# EAGLE design Parallel CS V5 (EAGLE 7.2.0)

## Sheet 1 of 2: Input Layer
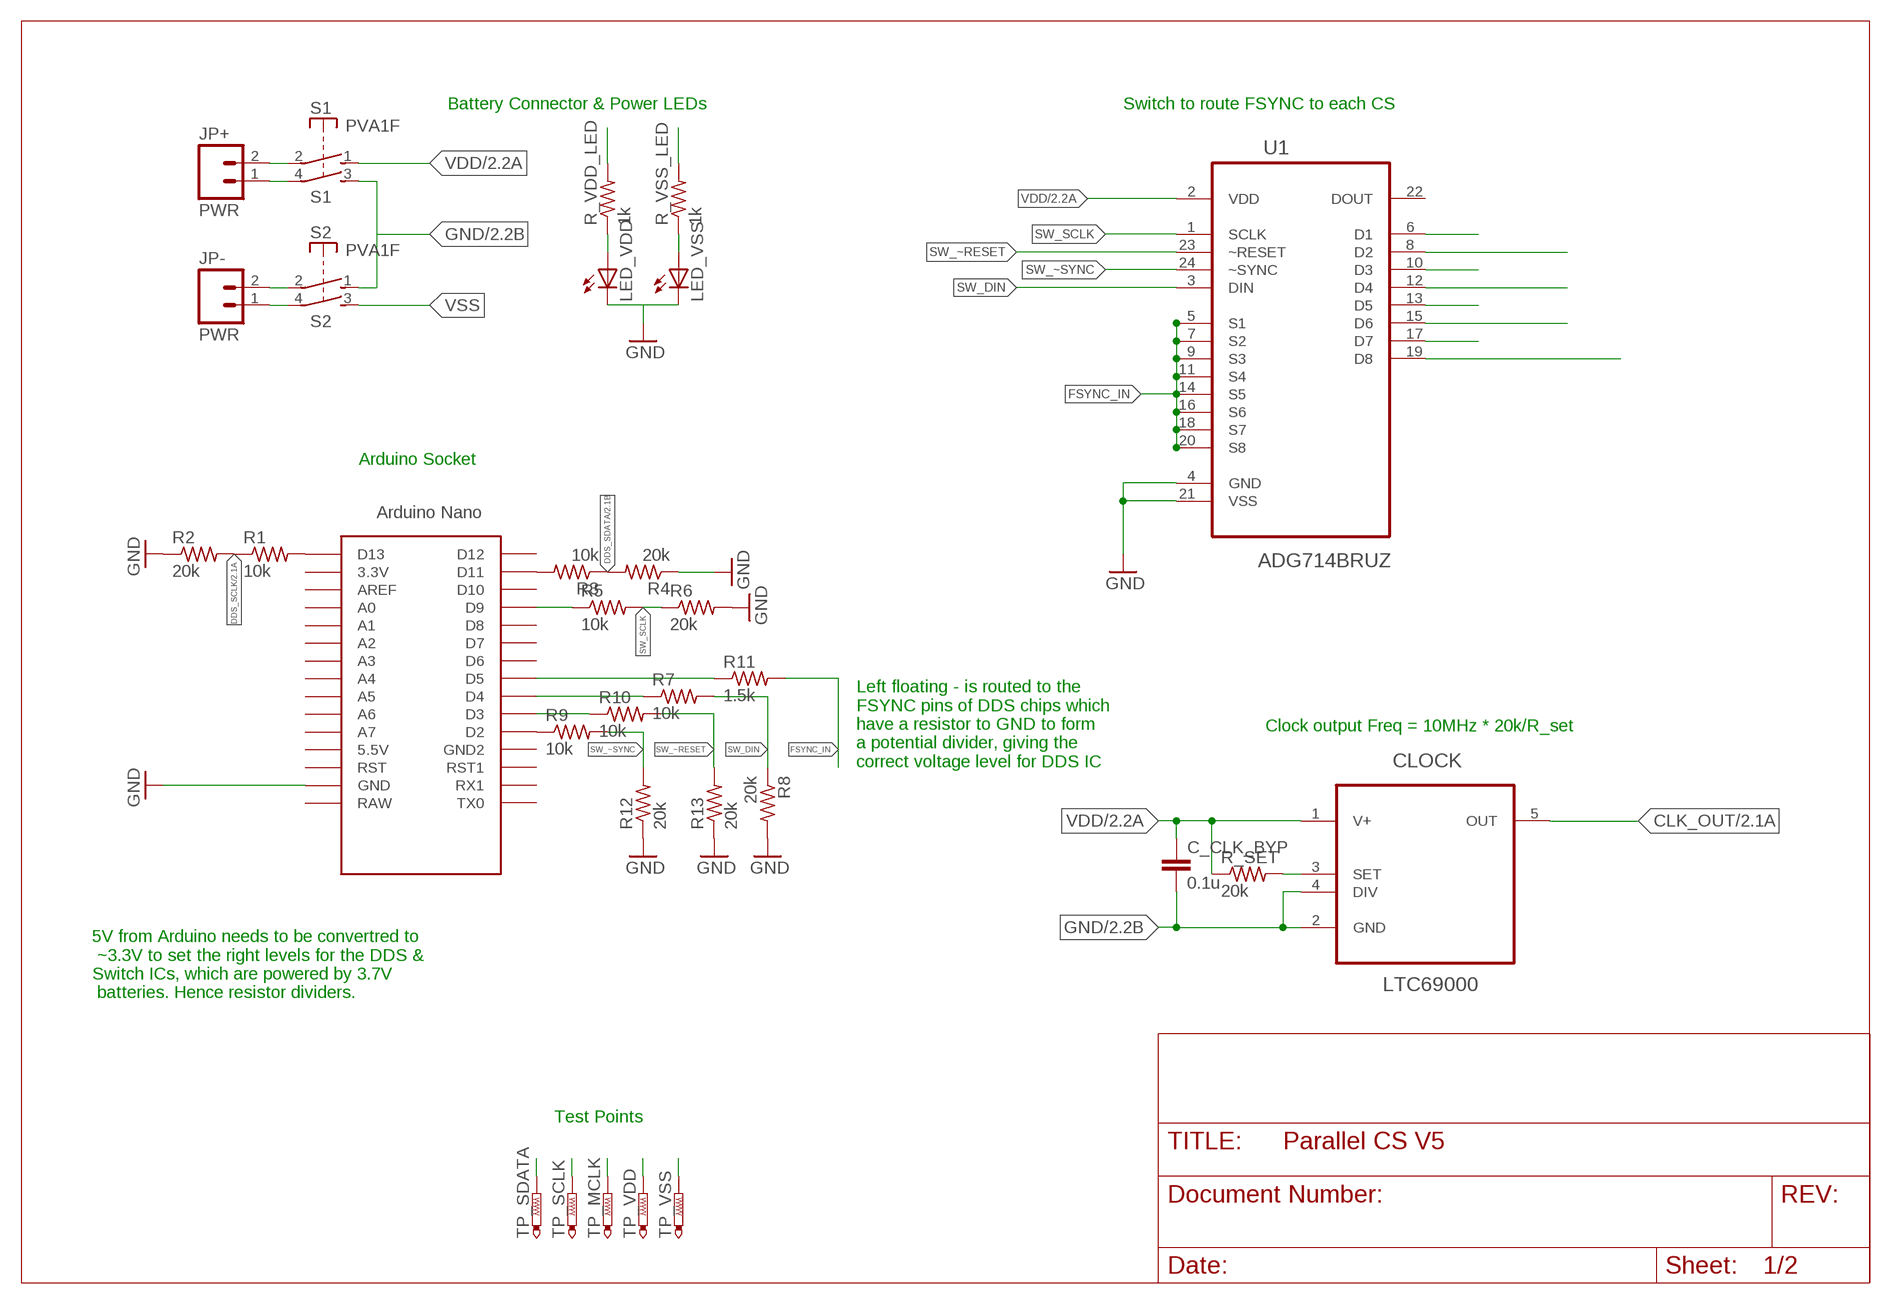
[diagram p0: schematic, sheet 1]

### Parts
C_CLK_BYP  0.1u  C-EUC0805  [C0805]
CLOCK  LTC69000  [SOT23-5L]
JP+  PWR  M02-JST-2MM-SMT  [JST-2-SMD]
JP-  PWR  M02-JST-2MM-SMT  [JST-2-SMD]
LED_VDD  LEDSML0805  [SML0805]
LED_VSS  LEDSML0805  [SML0805]
R1  10k  R-US_R0805  [R0805]
R2  20k  R-US_R0805  [R0805]
R3  10k  R-US_R0805  [R0805]
R4  20k  R-US_R0805  [R0805]
R5  10k  R-US_R0805  [R0805]
R6  20k  R-US_R0805  [R0805]
R7  10k  R-US_R0805  [R0805]
R8  20k  R-US_R0805  [R0805]
R9  10k  R-US_R0805  [R0805]
R10  10k  R-US_R0805  [R0805]
R11  1.5k  R-US_R0805  [R0805]
R12  20k  R-US_R0805  [R0805]
R13  20k  R-US_R0805  [R0805]
R_SET  20k  R-US_R0805  [R0805]
R_VDD_LED  1k  R-US_M0805  [M0805]
R_VSS_LED  1k  R-US_M0805  [M0805]
S1  PVA1F  [PVA1F]
S2  PVA1F  [PVA1F]
TP_MCLK  PTR1PAD1-13  [P1-13]
TP_SCLK  PTR1PAD1-13  [P1-13]
TP_SDATA  PTR1PAD1-13  [P1-13]
TP_VDD  PTR1PAD1-13  [P1-13]
TP_VSS  PTR1PAD1-13  [P1-13]
U1  ADG714BRUZ  [SOP65P640X120-24N]
U$1  NANO  [NANO]

### Nets
CLK_OUT: CLOCK.5(OUT) TP_MCLK.TP ; also sheet 2
DDS_SCLK: R1.1 R2.2 TP_SCLK.TP ; also sheet 2
DDS_SCLK_5V: R1.2 U$1.D13
DDS_SDATA: R3.1 R4.2 TP_SDATA.TP ; also sheet 2
FSYNC_CS1: U1.6(D1) ; also sheet 2
FSYNC_CS2: U1.8(D2)
FSYNC_CS3: U1.10(D3)
FSYNC_CS4: U1.12(D4)
FSYNC_CS5: U1.13(D5)
FSYNC_CS6: U1.15(D6)
FSYNC_CS7: U1.17(D7)
FSYNC_CS8: U1.19(D8)
FSYNC_IN: R11.2 U1.5(S1) U1.7(S2) U1.9(S3) U1.11(S4) U1.14(S5) U1.16(S6) U1.18(S7) U1.20(S8)
FSYNC_IN_5V: R11.1 U$1.D5
GND: C_CLK_BYP.2 CLOCK.2(GND) CLOCK.4(DIV) LED_VDD.C LED_VSS.C R2.1 R4.1 R6.2 R8.2 R12.1 R13.1 S1.3(2:S) S2.1(1:S) U1.4(GND) U1.21(VSS) U$1.GND ; also sheet 2
N$2: CLOCK.3(SET) R_SET.2
N$15: JP+.2 S1.2(1:P)
N$16: JP+.1 S1.4(2:P)
N$18: JP-.2 S2.2(1:P)
N$19: JP-.1 S2.4(2:P)
N$21: LED_VDD.A R_VDD_LED.1
N$22: LED_VSS.A R_VSS_LED.1
N$23: R3.2 U$1.D11
SW_DIN: R7.2 R8.1 U1.3(DIN)
SW_DIN_5V: R7.1 U$1.D4
SW_SCLK: R5.2 R6.1 U1.1(SCLK)
SW_SCLK_5V: R5.1 U$1.D9
SW_~RESET: R10.2 R13.2 U1.23(~RESET)
SW_~RESET_5V: R10.1 U$1.D3
SW_~SYNC: R9.2 R12.2 U1.24(~SYNC)
SW_~SYNC_5V: R9.1 U$1.D2
VDD: C_CLK_BYP.1 CLOCK.1(V+) R_SET.1 R_VDD_LED.2 S1.1(1:S) TP_VDD.TP U1.2(VDD) ; also sheet 2
VSS: R_VSS_LED.2 S2.3(2:S) TP_VSS.TP ; also sheet 2
Unconnected: U1.22(DOUT) U$1.3.3V U$1.5V(5.5V) U$1.A0 U$1.A1 U$1.A2 U$1.A3 U$1.A4 U$1.A5 U$1.A6 U$1.A7 U$1.AREF U$1.D6 U$1.D7 U$1.D8 U$1.D10 U$1.D12 U$1.GND1(GND2) U$1.ICSP1 U$1.ICSP2 U$1.ICSP3 U$1.ICSP4 U$1.ICSP5 U$1.ICSP6 U$1.RAW U$1.RST U$1.RST1 U$1.RX1 U$1.TX0

### Notes on the sheet
- Battery Connector & Power LEDs | Switch to route FSYNC to each CS
- Arduino Socket
- Clock output Freq = 10MHz * 20k/R_set
- Left floating - is routed to the
  FSYNC pins of DDS chips which
  have a resistor to GND to form
  a potential divider, giving the 
  correct voltage level for DDS IC
- 5V from Arduino needs to be convertred to
   ~3.3V to set the right levels for the DDS & 
  Switch ICs, which are powered by 3.7V
   batteries. Hence resistor dividers.
- Test Points

## Sheet 2 of 2: Current Source Block
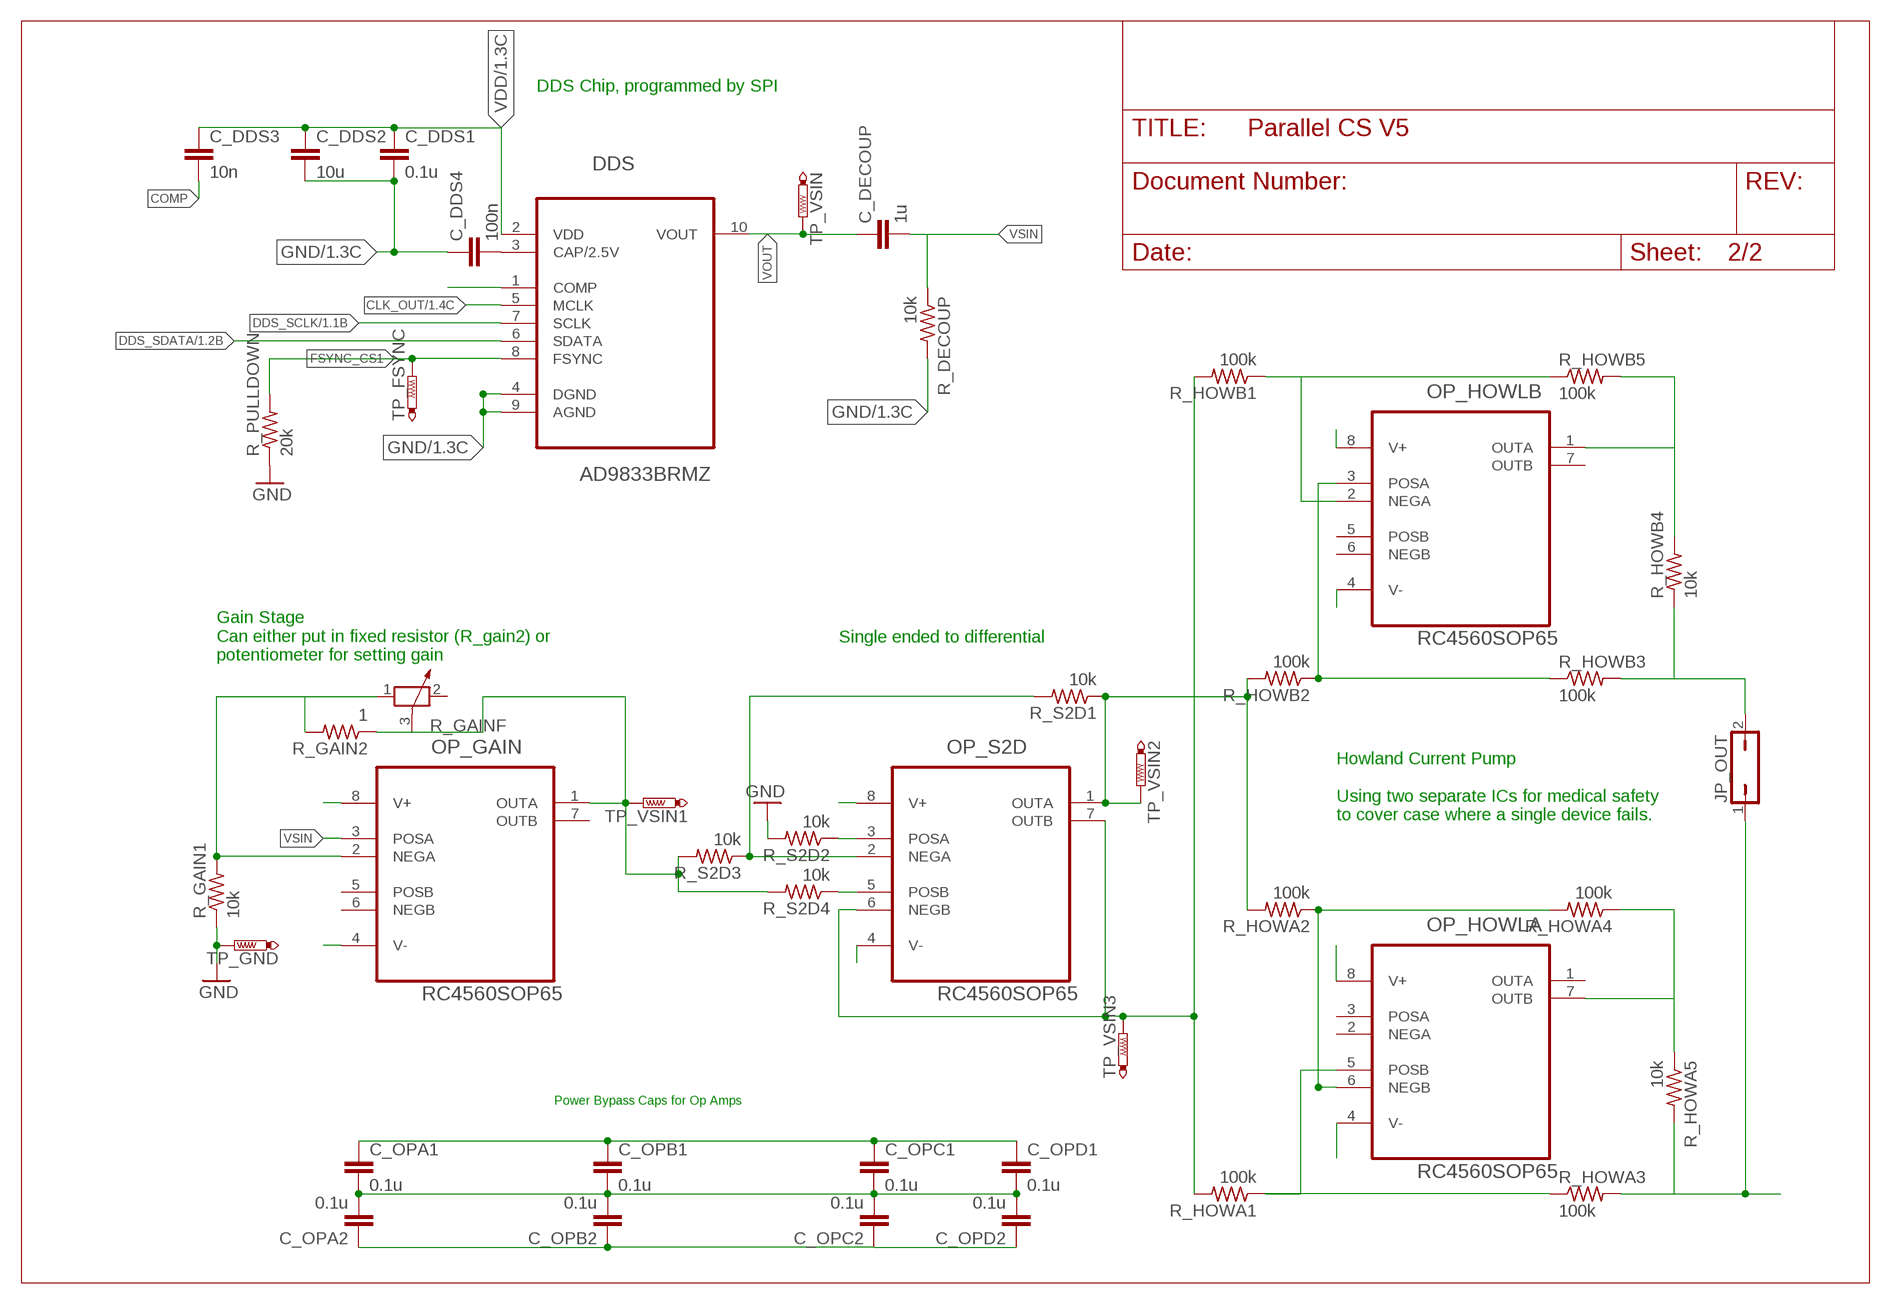
[diagram p1: schematic, sheet 2]

### Parts
C_DDS1  0.1u  C-EUC0805  [C0805]
C_DDS2  10u  C-EUC0805  [C0805]
C_DDS3  10n  C-EUC0805  [C0805]
C_DDS4  100n  C-EUC0805  [C0805]
C_DECOUP  1u  C-EUC0805  [C0805]
C_OPA1  0.1u  C-EUC0805  [C0805]
C_OPA2  0.1u  C-EUC0805  [C0805]
C_OPB1  0.1u  C-EUC0805  [C0805]
C_OPB2  0.1u  C-EUC0805  [C0805]
C_OPC1  0.1u  C-EUC0805  [C0805]
C_OPC2  0.1u  C-EUC0805  [C0805]
C_OPD1  0.1u  C-EUC0805  [C0805]
C_OPD2  0.1u  C-EUC0805  [C0805]
DDS  AD9833BRMZ  [SOP50P490X110-10N]
JP_OUT  JP1Q  [JP1]
OP_GAIN  RC4560SOP65  [SOP65P490X109-8N]
OP_HOWLA  RC4560SOP65  [SOP65P490X109-8N]
OP_HOWLB  RC4560SOP65  [SOP65P490X109-8N]
OP_S2D  RC4560SOP65  [SOP65P490X109-8N]
R_DECOUP  10k  R-US_R0805  [R0805]
R_GAIN1  10k  R-US_R0805  [R0805]
R_GAIN2  1  R-US_R0805  [R0805]
R_GAINF  POTENTIOMETER_PT-10  [PT-10]
R_HOWA1  100k  R-US_R0805  [R0805]
R_HOWA2  100k  R-US_R0805  [R0805]
R_HOWA3  100k  R-US_R0805  [R0805]
R_HOWA4  100k  R-US_R0805  [R0805]
R_HOWA5  10k  R-US_R0805  [R0805]
R_HOWB1  100k  R-US_R0805  [R0805]
R_HOWB2  100k  R-US_R0805  [R0805]
R_HOWB3  100k  R-US_R0805  [R0805]
R_HOWB4  10k  R-US_R0805  [R0805]
R_HOWB5  100k  R-US_R0805  [R0805]
R_PULLDOWN  20k  R-US_R0805  [R0805]
R_S2D1  10k  R-US_R0805  [R0805]
R_S2D2  10k  R-US_R0805  [R0805]
R_S2D3  10k  R-US_R0805  [R0805]
R_S2D4  10k  R-US_R0805  [R0805]
TP_FSYNC  PTR1PAD1-13  [P1-13]
TP_GND  PTR1PAD1-13  [P1-13]
TP_VSIN  PTR1PAD1-13  [P1-13]
TP_VSIN1  PTR1PAD1-13  [P1-13]
TP_VSIN2  PTR1PAD1-13  [P1-13]
TP_VSIN3  PTR1PAD1-13  [P1-13]

### Nets
CLK_OUT: DDS.5(MCLK) ; also sheet 1
COMP: C_DDS3.2 DDS.1(COMP)
DDS_SCLK: DDS.7(SCLK) ; also sheet 1
DDS_SDATA: DDS.6(SDATA) ; also sheet 1
FSYNC_CS1: DDS.8(FSYNC) R_PULLDOWN.2 TP_FSYNC.TP ; also sheet 1
GND: C_DDS1.2 C_DDS2.2 C_DDS4.1 C_OPA1.2 C_OPA2.2 C_OPB1.2 C_OPB2.2 C_OPC1.2 C_OPC2.2 C_OPD1.2 C_OPD2.2 DDS.4(DGND) DDS.9(AGND) R_DECOUP.2 R_GAIN1.1 R_PULLDOWN.1 R_S2D2.2 TP_GND.TP ; also sheet 1
N$1: C_DDS4.2 DDS.3(CAP/2.5V)
N$3: OP_GAIN.1(OUTA) R_GAIN2.1 R_GAINF.3 R_S2D3.2 R_S2D4.2 TP_VSIN1.TP
N$4: OP_S2D.6(NEGB) OP_S2D.7(OUTB) R_HOWA1.2 R_HOWB1.2 TP_VSIN3.TP
N$5: OP_GAIN.2(NEGA) R_GAIN1.2 R_GAIN2.2 R_GAINF.1
N$6: OP_S2D.5(POSB) R_S2D4.1
N$7: OP_HOWLA.5(POSB) R_HOWA1.1 R_HOWA3.1
N$8: OP_S2D.1(OUTA) R_HOWA2.2 R_HOWB2.2 R_S2D1.1 TP_VSIN2.TP
N$9: OP_S2D.3(POSA) R_S2D2.1
N$10: OP_S2D.2(NEGA) R_S2D1.2 R_S2D3.1
N$11: OP_HOWLB.3(POSA) R_HOWB2.1 R_HOWB3.1
N$12: OP_HOWLB.2(NEGA) R_HOWB1.1 R_HOWB5.1
N$13: JP_OUT.2 R_HOWB3.2 R_HOWB4.1
N$14: JP_OUT.1 R_HOWA3.2 R_HOWA5.2
N$17: OP_HOWLA.7(OUTB) R_HOWA4.1 R_HOWA5.1
N$20: OP_HOWLA.6(NEGB) R_HOWA2.1 R_HOWA4.2
N$24: OP_HOWLB.1(OUTA) R_HOWB4.2 R_HOWB5.2
VDD: C_DDS1.1 C_DDS2.1 C_DDS3.1 C_OPA1.1 C_OPB1.1 C_OPC1.1 C_OPD1.1 DDS.2(VDD) OP_GAIN.8(V+) OP_HOWLA.8(V+) OP_HOWLB.8(V+) OP_S2D.8(V+) ; also sheet 1
VOUT: C_DECOUP.1 DDS.10(VOUT) TP_VSIN.TP
VSIN: C_DECOUP.2 OP_GAIN.3(POSA) R_DECOUP.1
VSS: C_OPA2.1 C_OPB2.1 C_OPC2.1 C_OPD2.1 OP_GAIN.4(V-) OP_HOWLA.4(V-) OP_HOWLB.4(V-) OP_S2D.4(V-) ; also sheet 1
Unconnected: OP_GAIN.5(POSB) OP_GAIN.6(NEGB) OP_GAIN.7(OUTB) OP_HOWLA.1(OUTA) OP_HOWLA.2(NEGA) OP_HOWLA.3(POSA) OP_HOWLB.5(POSB) OP_HOWLB.6(NEGB) OP_HOWLB.7(OUTB) R_GAINF.2

### Notes on the sheet
- DDS Chip, programmed by SPI
- Single ended to differential
- Gain Stage
  Can either put in fixed resistor (R_gain2) or
  potentiometer for setting gain
- Howland Current Pump
  
  Using two separate ICs for medical safety
  to cover case where a single device fails.
- Power Bypass Caps for Op Amps

## Library data of the parts
C_CLK_BYP C_DDS1-C_DDS4 C_DECOUP C_OPA1 C_OPA2 C_OPB1 C_OPB2 C_OPC1 C_OPC2 C_OPD1 C_OPD2 = resistor:C-EU: CAPACITOR, European symbol
CLOCK = LTC6900:LTC69000: Low Power, 1kHz to 20MHz Resistor Set SOT-23 Oscillator
DDS = ad9833:AD9833BRMZ: Low Power 12.65 mW, 2.3 V to 5.5 V,Low Power 12.65 mW, 2.3 V to 5.5 V,Low Power 12.65 mW, 2.3 V to 5.5 V,Programmable Waveform Generator; MPN: AD9833BRMZ; OC_FARNELL: 1581966; OC_NEWARK: 19M1014; PACKAGE: MSOP-10; SUPPLIER: Analog Devices
JP+ JP- = SwitchBoard:M02: Header 2 Standard 2-pin 0.1" header. Use with straight break away headers (SKU : PRT-00116), right angle break away headers (PRT-00553), swiss pins (PRT-00743), machine pins (PRT-00117), and female headers (PRT-00115). Molex polarized connector foot print use with SKU : PRT-08233 with associated crimp pins and housings.
JP_OUT = jumper:JP1Q: JUMPER
LED_VDD LED_VSS = led:LED: LED OSRAM: - CHIPLED LG R971, LG N971, LY N971, LG Q971, LY Q971, LO R971, LY R971 LH N974, LH R974 LS Q976, LO Q976, LY Q976 LO Q996 - Hyper CHIPLED LW Q18S LB Q993, LB Q99A, LB R99A - SideLED LS A670, LO A670, LY A670, LG A670, LP A670 LB A673, LV A673, LT A673, LW A673 LH A674 LY A675 LS A676, LA A676, LO A676, LY A676, LW A676 LS A679, LY A679, LG A679 - Hyper Micro SIDELED® LS Y876, LA Y876, LO Y876, LY Y876 LT Y87S - SmartLED LW L88C, LW L88S LB L89C, LB L89S, LG L890 LS L89K, LO L89K, LY L89K LS L896, LA L896, LO L896, LY L896 - TOPLED LS T670, LO T670, LY T670, LG T670, LP T670 LSG T670, LSP T670, LSY T670, LOP T670, LYG T670 LG T671, LOG T671, LSG T671 LB T673, LV T673, LT T673, LW T673 LH T674 LS T676, LA T676, LO T676, LY T676, LB T676, LH T676, LSB T676, LW T676 LB T67C, LV T67C, LT T67C, LS T67K, LO T67K, LY T67K, LW E67C LS E67B, LA E67B, LO E67B, LY E67B, LB E67C, LV E67C, LT E67C LW T67C LS T679, LY T679, LG T679 LS T770, LO T770, LY T770, LG T770, LP T770 LB T773, LV T773, LT T773, LW T773 LH T774 LS E675, LA E675, LY E675, LS T675 LS T776, LA T776, LO T776, LY T776, LB T776 LHGB T686 LT T68C, LB T68C - Hyper Mini TOPLED® LB M676 - Mini TOPLED Santana® LG M470 LS M47K, LO M47K, LY M47K Source: http://www.osram.convergy.de LUXEON: - LUMILED® LXK2-PW12-R00, LXK2-PW12-S00, LXK2-PW14-U00, LXK2-PW14-V00 LXK2-PM12-R00, LXK2-PM12-S00, LXK2-PM14-U00 LXK2-PE12-Q00, LXK2-PE12-R00, LXK2-PE12-S00, LXK2-PE14-T00, LXK2-PE14-U00 LXK2-PB12-K00, LXK2-PB12-L00, LXK2-PB12-M00, LXK2-PB14-N00, LXK2-PB14-P00, LXK2-PB14-Q00 LXK2-PR12-L00, LXK2-PR12-M00, LXK2-PR14-Q00, LXK2-PR14-R00 LXK2-PD12-Q00, LXK2-PD12-R00, LXK2-PD12-S00 LXK2-PH12-R00, LXK2-PH12-S00 LXK2-PL12-P00, LXK2-PL12-Q00, LXK2-PL12-R00 Source: www.luxeon.com KINGBRIGHT: KA-3528ASYC Source: www.kingbright.com
OP_GAIN OP_HOWLA OP_HOWLB OP_S2D = RC4560:RC4560: RC4560 Op-Amp Texas Instruments
R1-R13 R_SET R_VDD_LED R_VSS_LED = resistor:R-US_: RESISTOR, American symbol
R_DECOUP R_GAIN1 R_GAIN2 R_HOWA1-R_HOWA5 R_HOWB1-R_HOWB5 R_PULLDOWN R_S2D1-R_S2D4 = rcl:R-US_: RESISTOR, American symbol
R_GAINF = rcl:POTENTIOMETER_: Potentiometer
S1 S2 = switch-misc:PVA1: ITT SWITCH
TP_FSYNC TP_GND TP_MCLK TP_SCLK TP_SDATA TP_VDD TP_VSIN TP_VSIN1-TP_VSIN3 TP_VSS = testpad:PTR1: TEST PIN
U1 = SwitchBoard:ADG714BRUZ: CMOS, Low Voltage Serially Controlled, Octal SPST Switches; MPN: ADG714BRUZ; OC_FARNELL: 9604367; OC_NEWARK: 59K1531; PACKAGE: TSSOP-24; SUPPLIER: Analog Devices
U$1 = Arduino-clone:NANO: Arduino Nano

## Board
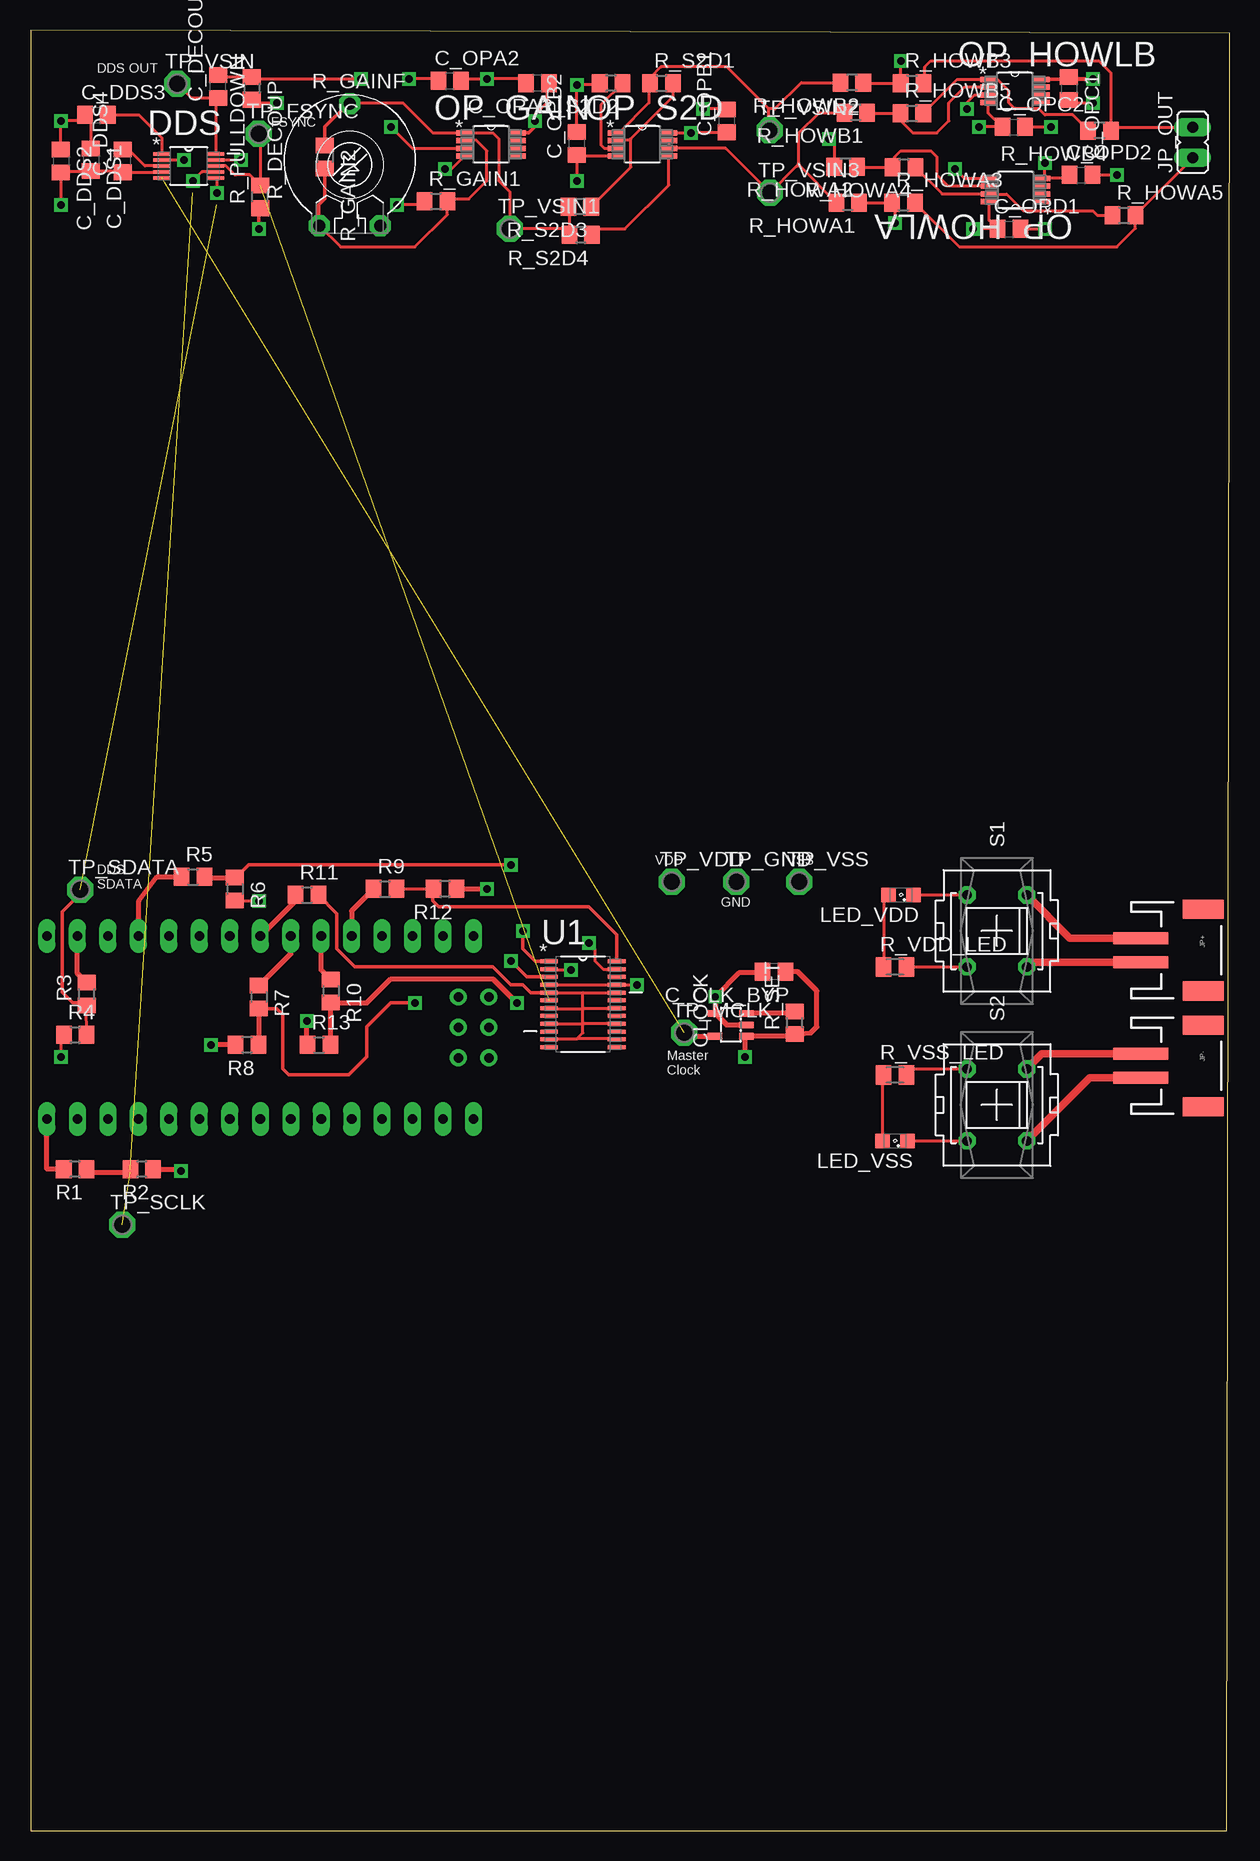
[diagram p2: board, top side]
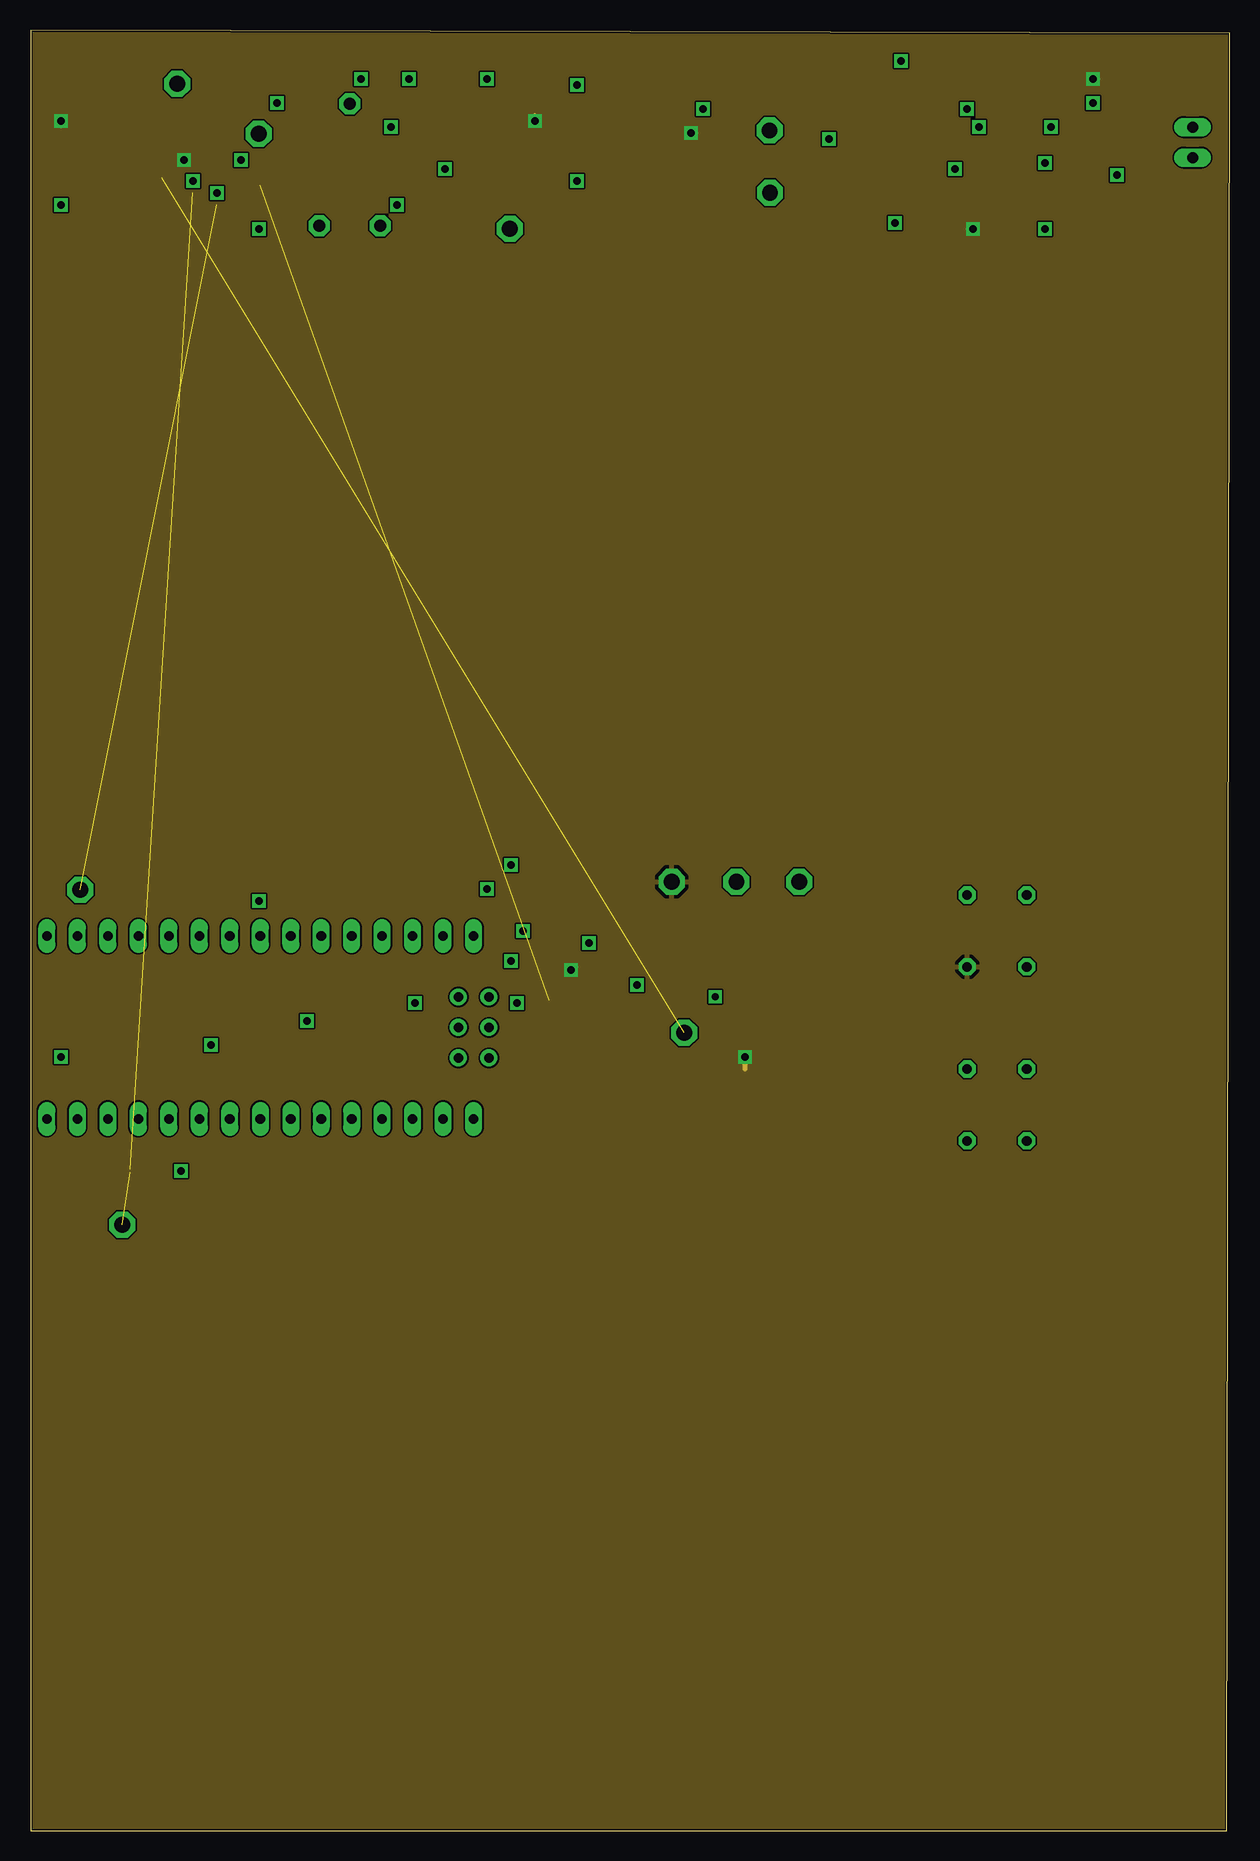
[diagram p3: board, inner layer VDD]
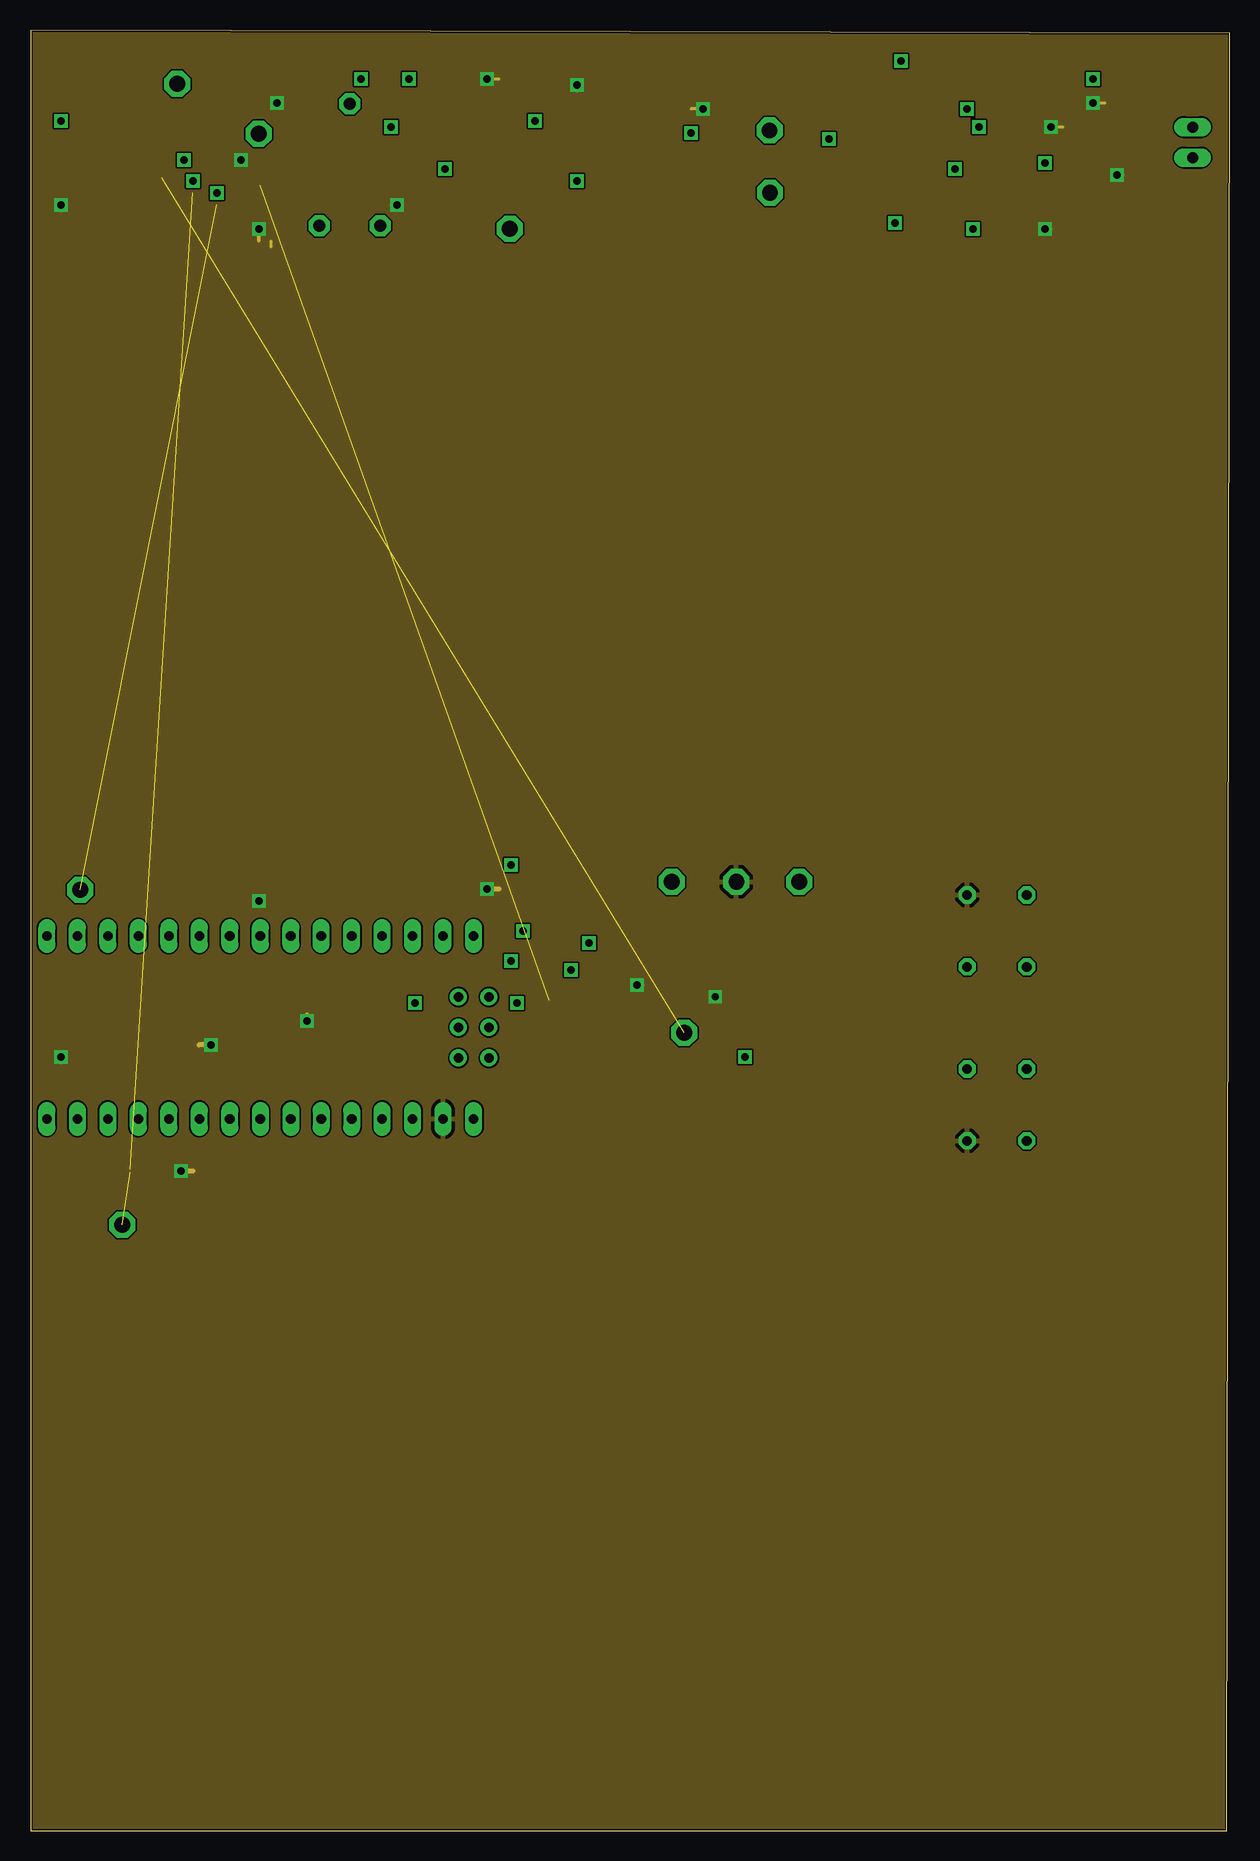
[diagram p4: board, inner layer GND]
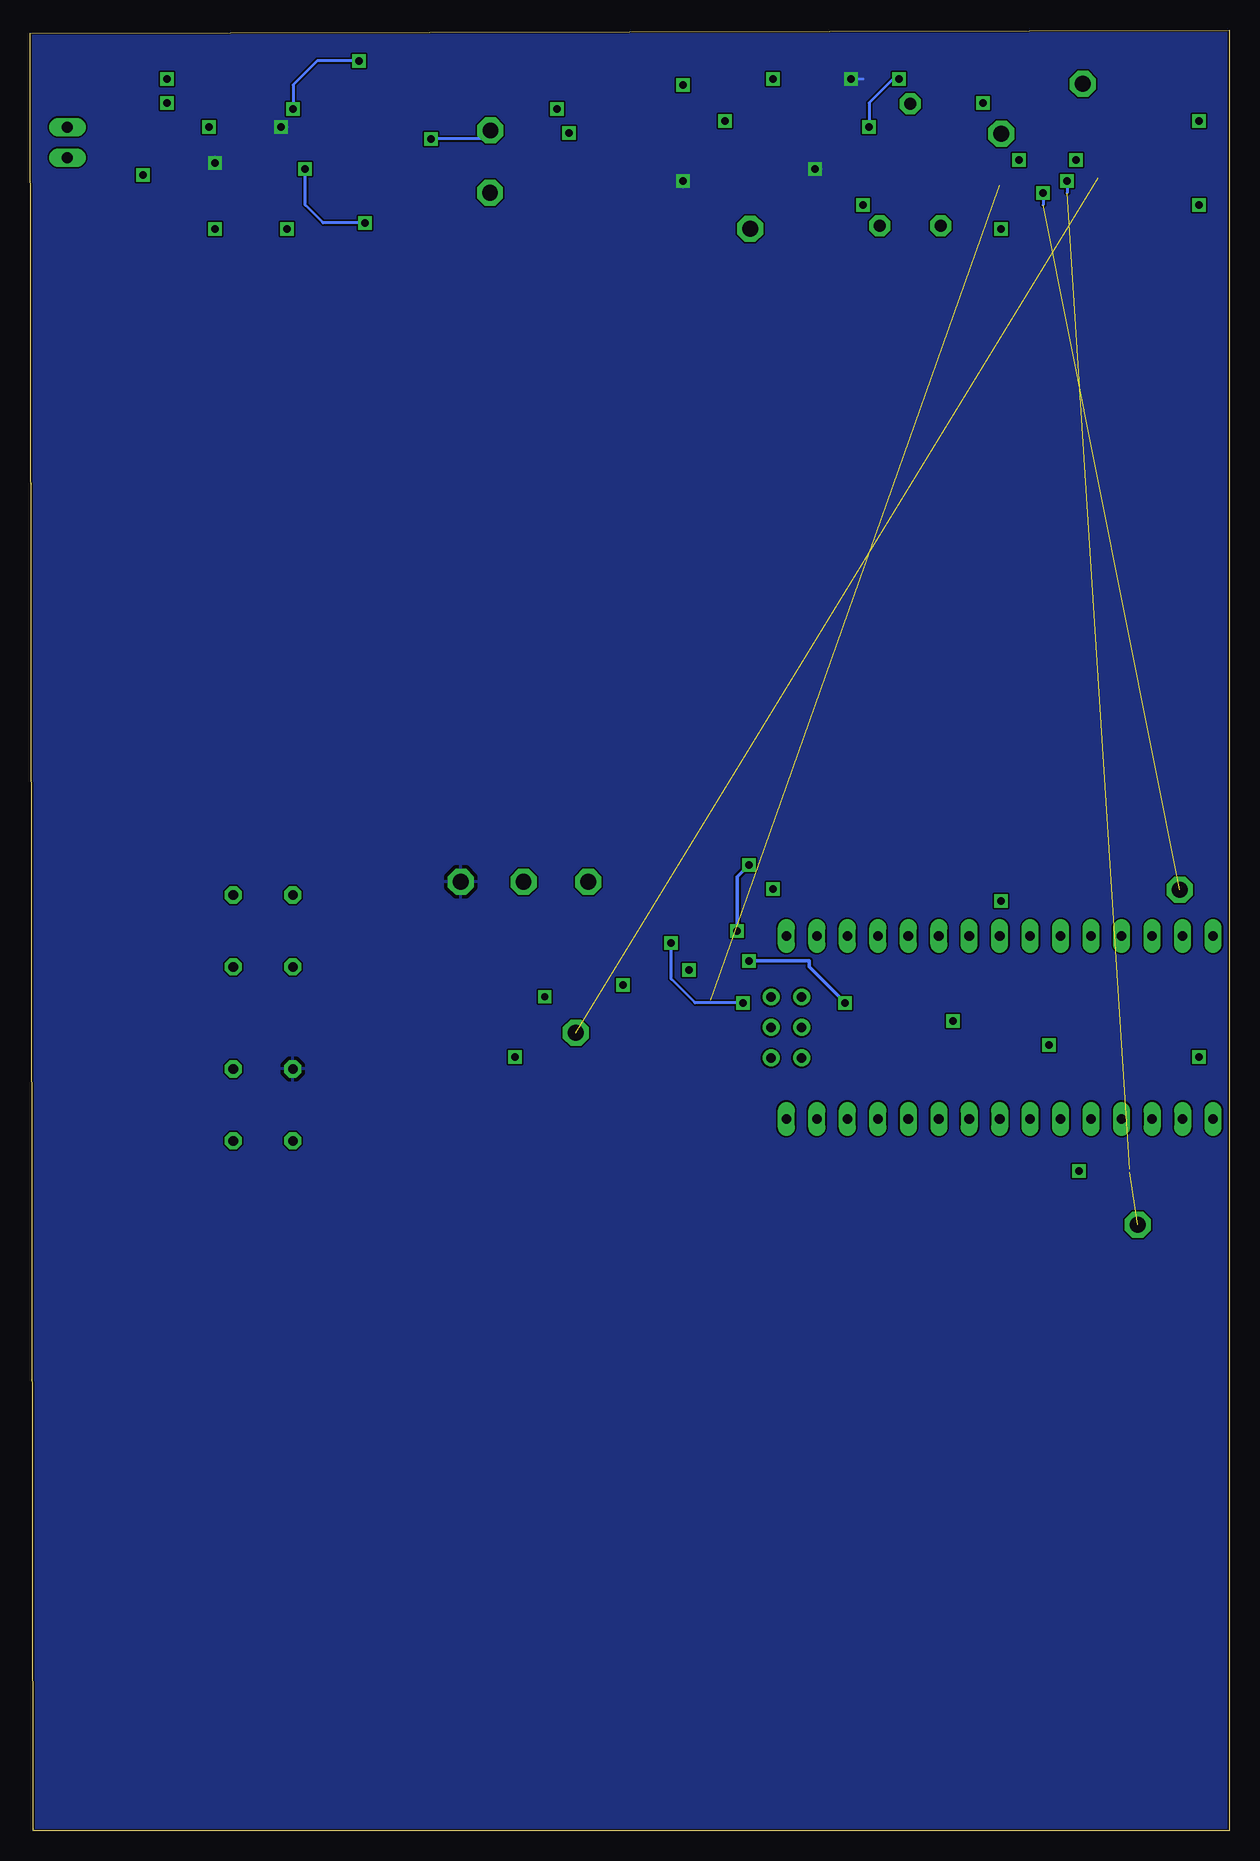
[diagram p5: board, bottom side, seen from below]

Size 99.92 x 150.08 mm. Coordinates in mm from the lower left corner, seen from the top.
Outline: 0,0 99.65,0 99.92,149.81 0,150.08 0,0
Copper layers (1*2*15*16): Top 0.035mm / dielectric 1.5mm / VDD 0.035mm / dielectric 0.15mm / GND 0.035mm / dielectric 0.2mm / Bottom 0.035mm
Design rules "SparkFun-4-layer": minimum track width 6mil, minimum drill 13mil, track to track 6mil, track to pad 6mil, pad to pad 6mil, via to via 6mil, smd to smd 6mil, copper to edge 6mil, drill to drill 8mil, minimum pad ring 12mil, minimum via ring 10mil, stop-mask expansion 4mil, vias tented up to drill 20mil, thermal gap 12mil

### Footprints (pad centres in the part's own frame; a part is rotated, then mirrored left to right if it is on the bottom)
C0805 = smd 1.3 x 1.5: 1 -0.95,0; 2 0.95,0
SOT23-5L = smd 0.55 x 1.2: 1 -0.95,-1.3; 2 0,-1.3; 3 0.95,-1.3; 4 0.95,1.3; 5 -0.95,1.3
SOP50P490X110-10N = smd 1.422 x 0.305: 1 -2.235,0.991; 2 -2.235,0.508; 3 -2.235,0; 4 -2.235,-0.508; 5 -2.235,-0.991; 6 2.235,-0.991; 7 2.235,-0.508; 8 2.235,0; 9 2.235,0.508; 10 2.235,0.991
JST-2-SMD = smd 1 x 4.6: 1 -1,-3.7; 2 1,-3.7 | smd 1.6 x 3.4: NC1 -3.4,1.5; NC2 3.4,1.5
JP1 = drill 0.914 long: 1 0,-1.27; 2 0,1.27
SML0805 = smd 1.2 x 1.2: A 1.05,0; C -1.05,0
SOP65P490X109-8N = smd 1.372 x 0.457: 1 -2.21,0.965; 2 -2.21,0.33; 3 -2.21,-0.33; 4 -2.21,-0.965; 5 2.21,-0.965; 6 2.21,-0.33; 7 2.21,0.33; 8 2.21,0.965
R0805 = smd 1.3 x 1.5: 1 -0.95,0; 2 0.95,0
PT-10 = drill 1.016 pad 1.778 octagon: 1 -2.54,-5.08; 2 2.54,-5.08; 3 0,5.08
M0805 = smd 1.3 x 1.6: 1 -0.95,0; 2 0.95,0
PVA1F = drill 0.813 octagon: 1 -2.997,2.489; 2 -2.997,-2.489; 3 2.997,2.489; 4 2.997,-2.489
P1-13 = drill 1.321 pad 2.159 octagon: TP 0,0
SOP65P640X120-24N = smd 1.473 x 0.356: 1 -2.819,3.581; 2 -2.819,2.921; 3 -2.819,2.286; 4 -2.819,1.626; 5 -2.819,0.965; 6 -2.819,0.33; 7 -2.819,-0.33; 8 -2.819,-0.965; 9 -2.819,-1.626; 10 -2.819,-2.286; 11 -2.819,-2.921; 12 -2.819,-3.581; 13 2.819,-3.581; 14 2.819,-2.921; 15 2.819,-2.286; 16 2.819,-1.626; 17 2.819,-0.965; 18 2.819,-0.33; 19 2.819,0.33; 20 2.819,0.965; 21 2.819,1.626; 22 2.819,2.286; 23 2.819,2.921; 24 2.819,3.581
NANO = drill 0.8 long: 3.3V -10.16,24.13; 5V -10.16,-1.27; A0 -10.16,19.05; A1 -10.16,16.51; A2 -10.16,13.97; A3 -10.16,11.43; A4 -10.16,8.89; A5 -10.16,6.35; A6 -10.16,3.81; A7 -10.16,1.27; AREF -10.16,21.59; D2 5.08,1.27; D3 5.08,3.81; D4 5.08,6.35; D5 5.08,8.89; D6 5.08,11.43; D7 5.08,13.97; D8 5.08,16.51; D9 5.08,19.05; D10 5.08,21.59; D11 5.08,24.13; D12 5.08,26.67; D13 -10.16,26.67; GND -10.16,-6.35; GND1 5.08,-1.27; RAW -10.16,-8.89; RST -10.16,-3.81; RST1 5.08,-3.81; RX1 5.08,-6.35; TX0 5.08,-8.89 | drill 0.8: ICSP1 -5.08,-10.16; ICSP2 -5.08,-7.62; ICSP3 -2.54,-10.16; ICSP4 -2.54,-7.62; ICSP5 0,-10.16; ICSP6 0,-7.62

### Placement (x,y rotation side)
C_CLK_BYP  61.92,71.59 180 top
C_DDS1  5,139.27 270 top
C_DDS2  2.5,139.16 270 top
C_DDS3  5.45,143 0 top
C_DDS4  7.65,139.18 90 top
C_DECOUP  15.59,145.38 90 top
C_OPA1  42.21,145.65 180 top
C_OPA2  34.9,145.85 0 top
C_OPB1  58,142.51 90 top
C_OPB2  45.5,140.62 90 top
C_OPC1  86.5,145.21 270 top
C_OPC2  81.9,142 0 top
C_OPD1  81.5,133.5 0 top
C_OPD2  87.5,138 0 top
CLOCK  58.32,67.18 90 top
DDS  13.15,138.75 0 top
JP+  96.18,73.4 270 top
JP-  96.18,63.75 270 top
JP_OUT  96.8,140.71 0 top
LED_VDD  72.5,78 180 top
LED_VSS  72,57.5 180 top
OP_GAIN  38.35,140.55 0 top
OP_HOWLA  82.05,136.75 180 top
OP_HOWLB  82,145 0 top
OP_S2D  50.95,140.55 0 top
R1  3.68,55.15 180 top
R2  9.23,55.15 180 top
R3  4.65,69.74 90 top
R4  3.69,66.35 0 top
R5  13.5,79.5 0 top
R6  17,78.5 270 top
R7  19,69.5 270 top
R8  18,65.5 180 top
R9  29.5,78.5 0 top
R10  25,70 270 top
R11  23,78 0 top
R12  34.5,78.5 180 top
R13  24,65.5 0 top
R_DECOUP  18.41,145.22 270 top
R_GAIN1  33.75,135.8 0 top
R_GAIN2  24.5,139.5 270 top
R_GAINF  26.57,138.85 0 top
R_HOWA1  68.07,135.7 180 top
R_HOWA2  67.89,138.7 180 top
R_HOWA3  72.71,135.7 0 top
R_HOWA4  72.75,138.65 180 top
R_HOWA5  91.09,134.65 0 top
R_HOWB1  68.73,143.2 180 top
R_HOWB2  68.41,145.7 180 top
R_HOWB3  73.43,145.65 0 top
R_HOWB4  89.05,141.7 180 top
R_HOWB5  73.41,143.15 0 top
R_PULLDOWN  19.09,136.18 90 top
R_S2D1  52.54,145.65 0 top
R_S2D2  48.35,145.65 180 top
R_S2D3  45.74,135.35 180 top
R_S2D4  45.82,133 180 top
R_SET  63.65,67.35 90 top
R_VDD_LED  72,72 0 top
R_VSS_LED  72,63 0 top
S1  80.5,75 90 top
S2  80.5,60.5 90 top
TP_FSYNC  18.97,141.43 0 top
TP_GND  58.79,79.09 0 top
TP_MCLK  54.43,66.51 0 top
TP_SCLK  7.61,50.51 0 top
TP_SDATA  4.11,78.43 0 top
TP_VDD  53.4,79.09 0 top
TP_VSIN  12.18,145.59 0 top
TP_VSIN1  39.91,133.51 0 top
TP_VSIN2  61.55,141.71 0 top
TP_VSIN3  61.59,136.51 0 top
TP_VSS  64.01,79.09 0 top
U1  46,68.89 0 top
U$1  28,69.5 90 top

### Tracks (layer width: path | path; a pad name or v marks a point on that pad's centre or on a via)
CLK_OUT  (1 unrouted)
  Top 0.406: TP_MCLK.TP 54.71,66.23 CLOCK.5
COMP
  Top 0.254: C_DDS3.2 9,143 10.91,141.09 DDS.1
DDS_SCLK  (via drill 0.6)  (2 unrouted)
  Top 0.254: R1.1 4.9,54.88 | DDS.7 15.38,138.25 14.25,138.25 v13.5,137.5
  Top 0.406: 4.9,54.88 8.28,54.88 R2.2
  Bottom 0.254: v13.5,137.5 13.5,136.5
DDS_SCLK_5V
  Top 0.406: R1.2 1.33,55.15 U$1.D13
DDS_SDATA  (via drill 0.6)  (1 unrouted)
  Top 0.254: R3.1 4.54,68.68 R4.2 | DDS.6 15.5,137.65 v15.5,136.5
  Top 0.305: R3.1 4.44,69 3.5,69 2.6,69.9 2.6,76.6 4.11,78.11 TP_SDATA.TP
  Bottom 0.254: v15.5,136.5 15.5,135.5
FSYNC_CS1  (1 unrouted)
  Top 0.254: DDS.8 16.25,138.75 17,138 18.22,138 R_PULLDOWN.2 19.09,141.31 TP_FSYNC.TP
FSYNC_IN
  Top 0.254: U1.5 46,69.86 | 46,69.86 U1.20 | U1.11 43.21,66 45.5,66 | 45.5,66 46,66.5 46,67.25 | 46,67.25 46,68.5 | 46,68.5 46,69.86 | U1.9 43.2,67.25 46,67.25 | U1.7 43.24,68.5 46,68.5 | U1.14 48.79,66 45.5,66 | U1.16 48.8,67.25 46,67.25 | U1.18 48.76,68.5 46,68.5
  Top 0.305: R11.2 25.5,76.45 25.5,73.5 27,72 38.5,72 40,70.5 41,70.5 41.65,69.86 U1.5
FSYNC_IN_5V
  Top 0.406: U$1.D5 22.05,77.52 R11.1
GND  (via drill 0.6)
  Top 0.254: v2.5,135.5 C_DDS2.2 2.61,138.32 C_DDS1.2 7.56,138.32 C_DDS4.1 7.66,138.24 DDS.4 | C_OPA2.2 36,146 v38,146 40.91,146 C_OPA1.2 | R_GAIN1.1 32.5,135.5 v30.5,135.5 | R_DECOUP.2 18.68,144 v20.5,144 | DDS.9 v17.5,139.25 | R6.2 17.15,77.5 v19,77.5 | R4.1 2.5,66.01 v2.5,64.5 | v50.5,70.5 48.84,70.5 U1.21 U1.4 | 45.5,141.5 C_OPB2.2 v45.5,145.5 47.5,145.5 47.5,145.55 R_S2D2.2 | C_OPB1.2 57.96,143.5 v56,143.5 | C_OPC2.2 v85,142 | C_OPD1.2 v84.5,133.5 | C_OPD2.2 v90.5,138 | C_OPC1.2 86.76,144 v88.5,144 | LED_VSS.C S2.1 | LED_VDD.C S1.3
  Top 0.305: R_PULLDOWN.1 19,135.14 v19,133.5
  Top 0.406: C_CLK_BYP.2 60.88,71.5 59,71.5 v57.02,69.52 CLOCK.4 57.97,67.18 CLOCK.2 | R2.1 12.5,55.15 v12.5,55 | R8.2 v15,65.5 | R13.1 23,65.5 v23,67.5 | R12.1 v38,78.5
  GND 0.254: v2.5,135.5 2.5,135 | 20,132.5 20,132 | v38,146 39,146 | v30.5,135.5 30,135.5 | v17.5,139.25 17.25,139.5 17.5,139.5 | v2.5,64.5 2.5,64 | v50.5,70.5 51,70.5 | v45.5,145.5 45.5,145 | v56,143.5 55,143.5 | v85,142 86,142 | v88.5,144 89.5,144 | v84.5,133.5 85,133.5 | v90.5,138 91,138
  GND 0.305: v19,133.5 19,132.5
  GND 0.406: v57.02,69.52 57,69.5 | v12.5,55 13.5,55 | v15,65.5 14,65.5 | v23,67.5 23,68 | v38,78.5 39,78.5
  pour GND: 105,153 105,150 105,-5 -9,-5 -11,-5 -11,153 -1,153
N$1
  Top 0.254: DDS.3 9.5,138.75 8.12,140.13 C_DDS4.2
N$2
  Top 0.406: R_SET.2 63.58,68.13 CLOCK.3
N$3
  Top 0.254: R_S2D3.2 44.87,135.27 R_S2D4.2 44.36,133.51 TP_VSIN1.TP 39.91,136.59 39,137.5 39,141 38.5,141.5 36.16,141.5 OP_GAIN.1 33.48,141.51 31,144 26.64,144 R_GAINF.3
  Top 0.305: R_GAIN2.1 24.5,142 26.43,143.93 R_GAINF.3
N$4
  Top 0.254: OP_S2D.7 OP_S2D.6 57.88,140.22 TP_VSIN3.TP 63.79,138.71 | 63.79,138.71 64,138.92 64,141.5 65.7,143.2 R_HOWB1.2 | R_HOWA1.2 64.11,138.71 63.79,138.71
N$5
  Top 0.254: 34.92,136.02 R_GAIN1.2 34.7,134.7 32,132 25.8,132 R_GAINF.1 | 35,136 36.5,136 38,137.5 38,140 37.12,140.88 OP_GAIN.2
  Top 0.305: R_GAINF.1 24,133.8 24,135.5 24.5,136 R_GAIN2.2 | 34.92,136.02 34.94,136 35,136
N$6
  Top 0.254: R_S2D4.1 47.27,133.5 49.5,133.5 53.16,137.16 OP_S2D.5
N$7  (via drill 0.6)
  Top 0.254: R_HOWA1.1 R_HOWA3.1 72,135.46 v72,134 | v77,138.5 77.78,137.72 OP_HOWLA.5
  Bottom 0.254: v72,134 75.5,134 77,135.5 v77,138.5
N$8  (via drill 0.6)
  Top 0.254: OP_S2D.1 49.02,141.51 51.5,144 51.5,145.56 R_S2D1.1 51.59,146.09 52.5,147 58,147 61.5,143.5 | TP_VSIN2.TP 61.5,141.76 61.5,143.5 | R_HOWB2.2 64.2,145.7 62,143.5 61.5,143.5 | v66.5,141 66.94,140.56 R_HOWA2.2
  Bottom 0.254: TP_VSIN2.TP 62.26,141 v66.5,141
N$9
  Top 0.254: R_S2D2.1 47.5,143.85 47.5,140.5 47.78,140.22 OP_S2D.3
N$10
  Top 0.254: R_S2D1.2 53.5,144.5 50,141 | 50,141 49.88,140.88 OP_S2D.2 | R_S2D3.1 50,138.66 50,141
N$11  (via drill 0.6)
  Top 0.254: R_HOWB2.1 69.41,145.65 R_HOWB3.1 72.5,145.67 v72.5,147.5 | v78,143.5 78,144 78.67,144.67 OP_HOWLB.3
  Bottom 0.254: v72.5,147.5 76,147.5 78,145.5 v78,143.5
N$12
  Top 0.254: R_HOWB1.1 69.73,143.15 R_HOWB5.1 72.5,143.11 72.5,142.5 73.5,141.5 75.5,141.5 76.5,142.5 76.5,144 77.83,145.33 OP_HOWLB.2
N$13
  Top 0.254: R_HOWB3.2 74.5,145.77 74.5,147 75,147.5 89,147.5 90,146.5 R_HOWB4.1 90.28,141.98 JP_OUT.2
N$14
  Top 0.254: R_HOWA3.2 77.36,132 90.5,132 92.04,133.54 R_HOWA5.2 96.8,139.41 JP_OUT.1
N$15
  Top 0.61: S1.2 83.39,72.4 JP+.2
N$16
  Top 0.61: S1.4 86.59,74.4 JP+.1
N$17
  Top 0.254: R_HOWA4.1 75.93,136.42 OP_HOWLA.7 79.86,136.4 81.3,136.4 82.7,135 88.5,135 88.85,134.65 R_HOWA5.1
N$18
  Top 0.61: S2.2 88.24,62.75 JP-.2
N$19
  Top 0.61: S2.4 84.24,64.75 JP-.1
N$20
  Top 0.254: R_HOWA2.1 68.89,138.65 R_HOWA4.2 72,138.85 72,139.5 72.5,140 75,140 75.5,139.5 75.5,138 76.42,137.08 OP_HOWLA.6
N$21
  Top 0.254: LED_VDD.A 71.05,77.6 R_VDD_LED.1
N$22
  Top 0.254: R_VSS_LED.1 70.95,62.9 LED_VSS.A
N$23
  Top 0.406: R3.2 3.87,71.47 U$1.D11
N$24
  Top 0.254: R_HOWB4.2 86.8,143 84.5,143 84,143.5 82,143.5 81.5,144 81.5,145 80.53,145.97 OP_HOWLB.1 77.17,145.97 R_HOWB5.2
SW_DIN  (via drill 0.6)
  Top 0.305: R7.2 19.05,68.5 20.5,68.5 21,68 21,63.5 21.5,63 26.5,63 28,64.5 28,67 30,69 v32,69 | v40,72.5 41.32,71.18 U1.3
  Top 0.406: R8.1 19,65.5 R7.2
  Bottom 0.305: v40,72.5 35,72.5 35,72 v32,69
SW_DIN_5V
  Top 0.406: R7.1 21.65,73.1 U$1.D4
SW_SCLK  (via drill 0.6)
  Top 0.254: R6.1 17.15,79.5
  Top 0.305: 17.15,79.5 18.15,80.5 v40,80.5 | v41,75 41,73.5 42.03,72.47 U1.1
  Top 0.406: R5.2 14.5,79.45 R6.1
  Bottom 0.305: v40,80.5 41,79.5 v41,75
SW_SCLK_5V
  Top 0.406: U$1.D9 9,74.63 9,77.5 10.5,79.5 R5.1
SW_~RESET  (via drill 0.6)
  Top 0.254: R10.2 24.85,68.9 | R13.2 24.5,65.15 | v46.5,74 47,73.5 47,72.5 47.69,71.81 U1.23
  Top 0.406: 24.85,68.9 24.95,68.8 R13.2 | R10.2 25.05,69 28,69 30,71 38.5,71 v40.5,69
  Bottom 0.254: v40.5,69 44.5,69 46.5,71 v46.5,74
SW_~RESET_5V
  Top 0.406: R10.1 24.19,71.76 U$1.D3
SW_~SYNC
  Top 0.254: R9.2 R12.2
  Top 0.305: R12.2 33.5,78.45 33.5,77.5 34,77 46.5,77 48.82,74.68 U1.24
SW_~SYNC_5V
  Top 0.406: R9.1 26.73,76.68 U$1.D2
VDD  (via drill 0.6)
  Top 0.254: DDS.2 10.92,139.25 v12.75,139.25 | C_DDS1.1 5,142.5 C_DDS3.1 4,142.5 v2.5,142.5 C_DDS2.1 | U1.2 43.24,71.75 v45,71.75 | C_OPA1.1 43,145.49 43,144 42,143 v42,142.5 | OP_S2D.8 53.17,141.5 v55,141.5 57.94,141.5 C_OPB1.1 | v78.5,133.5 C_OPD1.1 79.84,134.21 OP_HOWLA.8 | OP_HOWLB.8 84.25,146 | R_VDD_LED.2 S1.1
  Top 0.305: OP_GAIN.8 40.58,141.5 41.5,141.5 42,142 v42,142.5 | C_OPC1.1 86.66,146 v88.5,146 88.47,145.97 OP_HOWLB.8
  Top 0.406: C_CLK_BYP.1 63.91,71.59 65.5,70 65.5,67 65,66.5 R_SET.1 63.38,66.23 CLOCK.1 59.5,66.11 v59.5,64.5
  VDD 0.254: v12.75,139.25 12.5,139 13,139 | v2.5,142.5 2.5,142 | v45,71.75 45.25,72 45.5,72 | v55,141.5 55.5,141.5 | v78.5,133.5 78,133.5 | v88.5,146 89,146
  VDD 0.305: v42,142.5 42,143
  VDD 0.406: v59.5,64.5 59.5,63.5
  pour VDD: -4,154 110,154 110,153 110,-31 -9,-31 -9,-27 -9,154
VOUT
  Top 0.254: DDS.10 15.38,144.22 C_DECOUP.1 13.34,144.43 TP_VSIN.TP
VSIN  (via drill 0.6)
  Top 0.254: C_DECOUP.2 15.75,146.17 R_DECOUP.1 18.58,146 v27.5,146 | v30,142 31.78,140.22 OP_GAIN.3
  Bottom 0.254: v27.5,146 28,146 30,144 v30,142
VSS  (via drill 0.6)
  Top 0.254: C_OPA2.1 33.8,146 v31.5,146 | OP_S2D.4 45.59,139.59 C_OPB2.1 v45.5,137.5 | OP_GAIN.4 35.05,138.5 v34.5,138.5 | OP_HOWLB.4 79.79,143.16 C_OPC2.1 v79,142 | C_OPD2.1 86.27,137.72 OP_HOWLA.4 84.5,137.96 v84.5,139 | R_VSS_LED.2 73.45,63.5 S2.3
  Bottom 0.254: v31.5,146 30.5,146 | v45.5,137.5 45.5,137 | v34.5,138.5 34,138.5 | v79,142 78.5,142 | v84.5,139 84.5,139.5
  pour Bottom: -11,156 -9,154 110.5,154 107,150.5 107,-10.5 104,-7.5 -13,-7.5 -11.5,-6 -11.5,150 -11,150.5

### Text on the board
tValues: Vdiff A | Vdiff B | DDS / Decoup
tSilk: DDS OUT | FSYNC | VDD | VSS | DDS / SDATA | GND | Master / Clock